# EAGLE design ArduPilotMega_v1 (EAGLE 9.6.2)
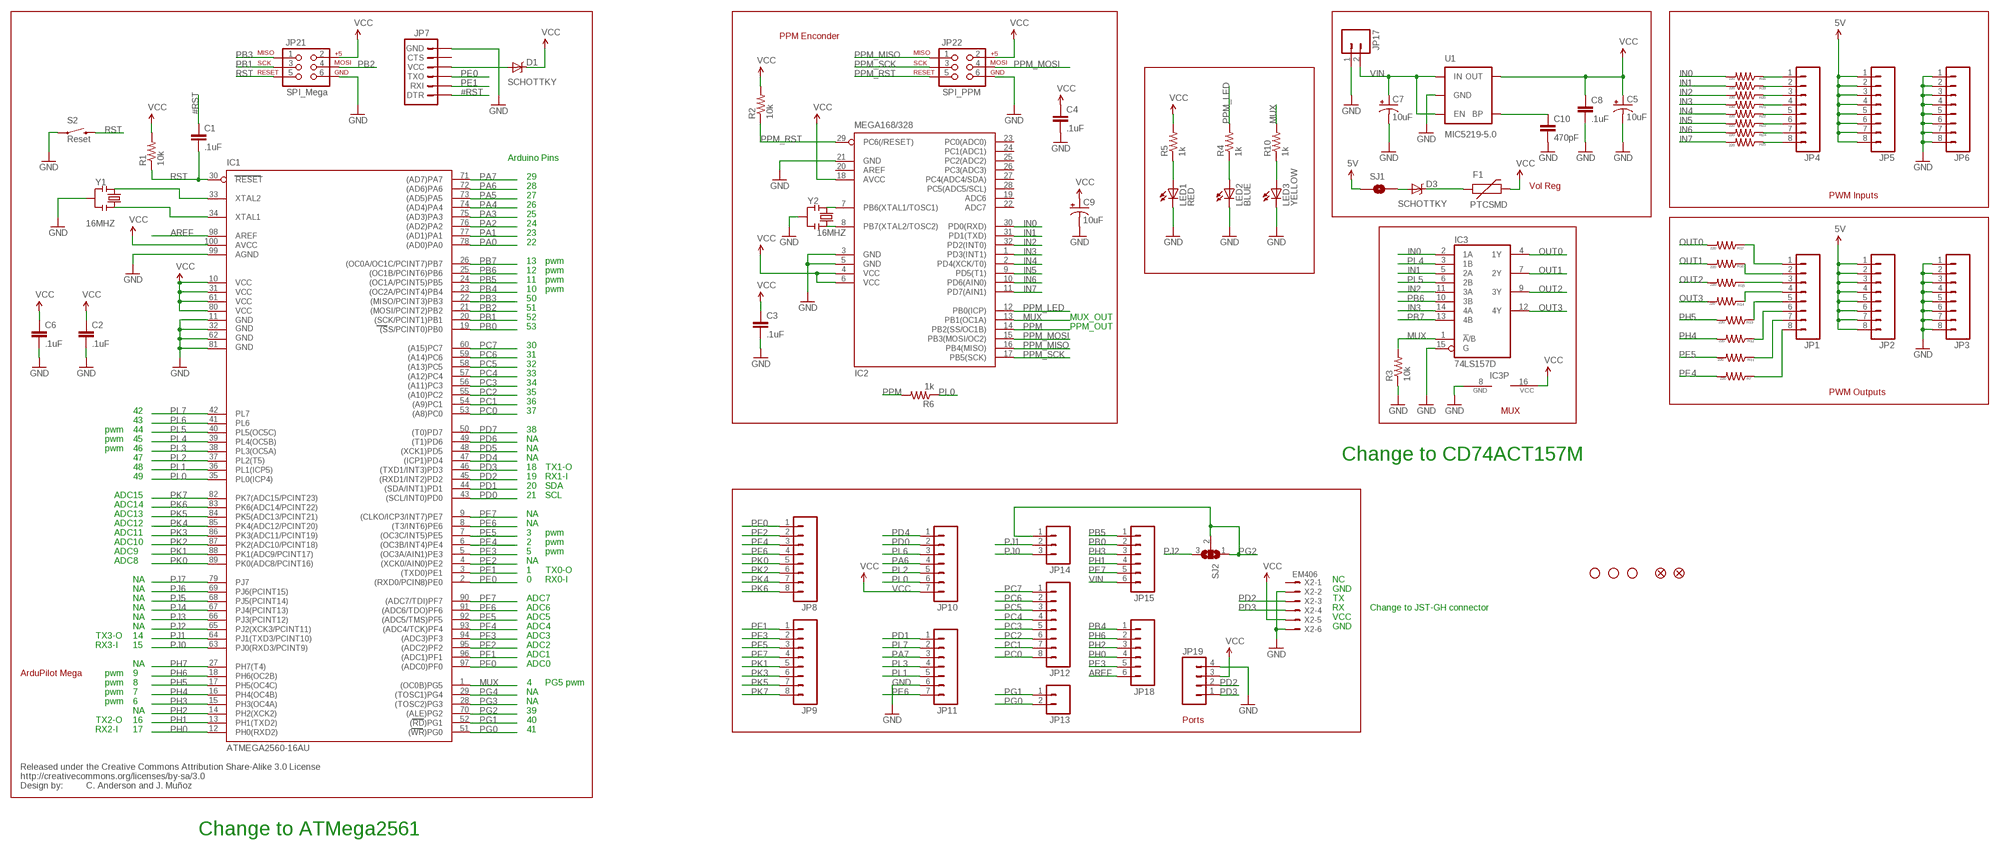
[diagram p0: schematic, sheet 1]

## Parts
C1  .1uF  CAP0402  [C0402]
C2  .1uF  CAP0402  [C0402]
C3  .1uF  CAP0402  [C0402]
C4  .1uF  CAP0402  [C0402]
C5  10uF  CAP_POL1206  [EIA3216]
C6  .1uF  CAP0402  [C0402]
C7  10uF  CAP_POL1206  [EIA3216]
C8  .1uF  CAP0402  [C0402]
C9  10uF  CAP_POL1206  [EIA3216]
C10  470pF  CAP0402  [C0402]
D1  SCHOTTKY  DIODE-SCHOTTKY_  [SMA-DIODE]
D3  SCHOTTKY  DIODE-SCHOTTKY_  [SMA-DIODE]
F1  PTCSMD  [PTC-1206]
IC1  ATMEGA2560-16AU  ATMEGA1280-16AU  [TQFP100]
IC2  MEGA168/328  MEGA8-AI  [TQFP32-08]
IC3  74LS157D  [SO16]
JP1  M08  [1X08]
JP2  M08  [1X08]
JP3  M08  [1X08]
JP4  M08  [1X08]
JP5  M08  [1X08]
JP6  M08  [1X08]
JP7  ARDUINO_SERIAL_PROGRAMPTH  [1X06]
JP8  M08  [1X08]
JP9  M08  [1X08]
JP10  M07  [1X07]
JP11  M07  [1X07]
JP12  M08  [1X08]
JP13  M02PTH  [1X02]
JP14  M03PTH  [1X03]
JP15  M06SIP  [1X06]
JP16  FIDUCIAL1X2  [FIDUCIAL-1X2]
JP17  M02NG  [1X02]
JP18  M06SIP  [1X06]
JP19  M04PTH  [1X04]
JP20  FIDUCIAL1X2  [FIDUCIAL-1X2]
JP21  SPI_Mega  AVR_SPI_PRG_6NS  [2X3-NS]
JP22  SPI_PPM  AVR_SPI_PRG_6NS  [2X3-NS]
LED1  RED  LED0603  [LED-0603]
LED2  BLUE  LED0603  [LED-0603]
LED3  YELLOW  LED0603  [LED-0603]
R1  10k  RESISTOR0402  [C0402]
R2  10k  RESISTOR0402  [C0402]
R3  10k  RESISTOR0402  [C0402]
R4  1k  RESISTOR0402  [C0402]
R5  1k  RESISTOR0402  [C0402]
R6  1k  RESISTOR0402  [C0402]
R7  220  RESISTOR0402  [C0402]
R10  1k  RESISTOR0402  [C0402]
R11  220  RESISTOR0402  [C0402]
R12  220  RESISTOR0402  [C0402]
R13  220  RESISTOR0402  [C0402]
R14  220  RESISTOR0402  [C0402]
R15  220  RESISTOR0402  [C0402]
R16  220  RESISTOR0402  [C0402]
R17  220  RESISTOR0402  [C0402]
R18  220  RESISTOR0402  [C0402]
R19  220  RESISTOR0402  [C0402]
R20  220  RESISTOR0402  [C0402]
R21  220  RESISTOR0402  [C0402]
R22  220  RESISTOR0402  [C0402]
R23  220  RESISTOR0402  [C0402]
R24  220  RESISTOR0402  [C0402]
R25  220  RESISTOR0402  [C0402]
S2  Reset  SWITCH-MOMENTARY-2SMD  [TACTILE_SWITCH_SMD]
SJ1  SJ2  SOLDERJUMPERNC  [SJ_2S]
SJ2  SOLDERJUMPER_2WAYS  [SJ_3]
U1  MIC5219-5.0  V_REG_LDOSMD  [SOT23-5]
U$8  CREATIVE_COMMONS  [CREATIVE_COMMONS]
U$10  STAND-OFF  [STAND-OFF]
U$12  STAND-OFF  [STAND-OFF]
U$13  STAND-OFF  [STAND-OFF]
X2  EM406  GH-06V  [GH-06V]
Y1  16MHZ  RESONATORSMD  [RESONATOR-SMD]
Y2  16MHZ  RESONATORSMD  [RESONATOR-SMD]

## Nets
5V: JP2.1 JP2.2 JP2.3 JP2.4 JP2.5 JP2.6 JP2.7 JP2.8 JP5.1 JP5.2 JP5.3 JP5.4 JP5.5 JP5.6 JP5.7 JP5.8 SJ1.1
#RST: C1.1 JP7.1(DTR)
AREF: IC1.98(AREF) JP18.6
GND: C2.2 C3.2 C4.2 C5.C(-) C6.2 C7.C(-) C8.2 C9.C(-) C10.2 IC1.11(GND) IC1.32(GND1) IC1.62(GND2) IC1.81(GND3) IC1.99(AGND) IC2.3(GND) IC2.5(GND) IC2.21(GND) IC3.8(GND) IC3.15(G) JP3.1 JP3.2 JP3.3 JP3.4 JP3.5 JP3.6 JP3.7 JP3.8 JP6.1 JP6.2 JP6.3 JP6.4 JP6.5 JP6.6 JP6.7 JP6.8 JP7.6(GND) JP11.6 JP17.1 JP19.4 JP21.6 JP22.6 LED1.C LED2.C LED3.C R3.1 S2.1 U1.2(GND) X2.2 X2.6 Y1.2 Y2.2
IN0: IC2.30(PD0(RXD)) IC3.2(1A) R18.2
IN1: IC2.31(PD1(TXD)) IC3.5(2A) R19.2
IN2: IC2.32(PD2(INT0)) IC3.11(3A) R20.2
IN3: IC2.1(PD3(INT1)) IC3.14(4A) R21.2
IN4: IC2.2(PD4(XCK/T0)) R22.2
IN5: IC2.9(PD5(T1)) R23.2
IN6: IC2.10(PD6(AIN0)) R24.2
IN7: IC2.11(PD7(AIN1)) R25.2
MUX: IC1.1((OC0B)PG5) IC2.13(PB1(OC1A)) IC3.1(!A!/B) R3.2 R10.2
N$1: LED1.A R5.1
N$2: LED2.A R4.1
N$3: C10.1 U1.4(BP)
N$5: LED3.A R10.1
N$6: IC2.7(PB6(XTAL1/TOSC1)) Y2.1
N$7: IC2.8(PB7(XTAL2/TOSC2)) Y2.3
N$8: JP1.5 R13.1
N$9: JP1.6 R12.1
N$10: JP1.7 R11.1
N$11: JP1.8 R7.1
N$13: JP1.4 R14.1
N$14: JP1.3 R15.1
N$15: JP1.2 R16.1
N$16: JP1.1 R17.1
N$17: D3.A SJ1.2
N$18: JP4.1 R18.1
N$19: JP4.2 R19.1
N$20: JP4.3 R20.1
N$21: JP4.4 R21.1
N$22: JP4.5 R22.1
N$23: JP4.6 R23.1
N$24: JP4.7 R24.1
N$25: JP4.8 R25.1
N$26: D3.C F1.1
N$27: D1.A JP7.4(VCC)
N$56: IC1.34(XTAL1) Y1.3
N$89: IC1.33(XTAL2) Y1.1
OUT0: IC3.4(1Y) R17.2
OUT1: IC3.7(2Y) R16.2
OUT2: IC3.9(3Y) R15.2
OUT3: IC3.12(4Y) R14.2
PA0: IC1.78((AD0)PA0)
PA1: IC1.77((AD1)PA1)
PA2: IC1.76((AD2)PA2)
PA3: IC1.75((AD3)PA3)
PA4: IC1.74((AD4)PA4)
PA5: IC1.73((AD5)PA5)
PA6: IC1.72((AD6)PA6) JP10.4
PA7: IC1.71((AD7)PA7) JP11.3
PB0: IC1.19((SS/PCINT0)PB0) JP15.2
PB1: IC1.20((SCK/PCINT1)PB1) JP21.3
PB2: IC1.21((MOSI/PCINT2)PB2) JP21.4
PB3: IC1.22((MISO/PCINT3)PB3) JP21.1
PB4: IC1.23((OC2A/PCINT4)PB4) JP18.1
PB5: IC1.24((OC1A/PCINT5)PB5) JP15.1
PB6: IC1.25((OC1B/PCINT6)PB6) IC3.10(3B)
PB7: IC1.26((OC0A/OC1C/PCINT7)PB7) IC3.13(4B)
PC0: IC1.53((A8)PC0) JP12.8
PC1: IC1.54((A9)PC1) JP12.7
PC2: IC1.55((A10)PC2) JP12.6
PC3: IC1.56((A11)PC3) JP12.5
PC4: IC1.57((A12)PC4) JP12.4
PC5: IC1.58((A13)PC5) JP12.3
PC6: IC1.59((A14)PC6) JP12.2
PC7: IC1.60((A15)PC7) JP12.1
PD0: IC1.43((SCL/INT0)PD0) JP10.2
PD1: IC1.44((SDA/INT1)PD1) JP11.1
PD2: IC1.45((RXD1/INT2)PD2) JP19.2 X2.3
PD3: IC1.46((TXD1/INT3)PD3) JP19.1 X2.4
PD4: IC1.47((ICP1)PD4) JP10.1
PD5: IC1.48((XCK1)PD5)
PD6: IC1.49((T1)PD6)
PD7: IC1.50((T0)PD7)
PE0: IC1.2((RXD0/PCIN8)PE0) JP7.3(TXO)
PE1: IC1.3((TXD0)PE1) JP7.2(RXI)
PE2: IC1.4((XCK0/AIN0)PE2)
PE3: IC1.5((OC3A/AIN1)PE3) JP18.5
PE4: IC1.6((OC3B/INT4)PE4) R7.2
PE5: IC1.7((OC3C/INT5)PE5) R11.2
PE6: IC1.8((T3/INT6)PE6) JP11.7
PE7: IC1.9((CLKO/ICP3/INT7)PE7) JP15.5
PF0: IC1.97((ADC0)PF0) JP8.1
PF1: IC1.96((ADC1)PF1) JP9.1
PF2: IC1.95((ADC2)PF2) JP8.2
PF3: IC1.94((ADC3)PF3) JP9.2
PF4: IC1.93((ADC4/TCK)PF4) JP8.3
PF5: IC1.92((ADC5/TMS)PF5) JP9.3
PF6: IC1.91((ADC6/TDO)PF6) JP8.4
PF7: IC1.90((ADC7/TDI)PF7) JP9.4
PG0: IC1.51((WR)PG0) JP13.2
PG1: IC1.52((RD)PG1) JP13.1
PG2: IC1.70((ALE)PG2) JP14.1 SJ2.1 SJ2.2
PG3: IC1.28((TOSC2)PG3)
PG4: IC1.29((TOSC1)PG4)
PH0: IC1.12(PH0(RXD2)) JP18.4
PH1: IC1.13(PH1(TXD2)) JP15.4
PH2: IC1.14(PH2(XCK2)) JP18.3
PH3: IC1.15(PH3(OC4A)) JP15.3
PH4: IC1.16(PH4(OC4B)) R12.2
PH5: IC1.17(PH5(OC4C)) R13.2
PH6: IC1.18(PH6(OC2B)) JP18.2
PH7: IC1.27(PH7(T4))
PJ0: IC1.63(PJ0(RXD3/PCINT9)) JP14.3
PJ1: IC1.64(PJ1(TXD3/PCINT10)) JP14.2
PJ2: IC1.65(PJ2(XCK3/PCINT11)) SJ2.3
PJ3: IC1.66(PJ3(PCINT12))
PJ4: IC1.67(PJ4(PCINT13))
PJ5: IC1.68(PJ5(PCINT14))
PJ6: IC1.69(PJ6(PCINT15))
PJ7: IC1.79(PJ7)
PK0: IC1.89(PK0(ADC8/PCINT16)) JP8.5
PK1: IC1.88(PK1(ADC9/PCINT17)) JP9.5
PK2: IC1.87(PK2(ADC10/PCINT18)) JP8.6
PK3: IC1.86(PK3(ADC11/PCINT19)) JP9.6
PK4: IC1.85(PK4(ADC12/PCINT20)) JP8.7
PK5: IC1.84(PK5(ADC13/PCINT21)) JP9.7
PK6: IC1.83(PK6(ADC14/PCINT22)) JP8.8
PK7: IC1.82(PK7(ADC15/PCINT23)) JP9.8
PL0: IC1.35(PL0(ICP4)) JP10.6 R6.1
PL1: IC1.36(PL1(ICP5)) JP11.5
PL2: IC1.37(PL2(T5)) JP10.5
PL3: IC1.38(PL3(OC5A)) JP11.4
PL4: IC1.39(PL4(OC5B)) IC3.3(1B)
PL5: IC1.40(PL5(OC5C)) IC3.6(2B)
PL6: IC1.41(PL6) JP10.3
PL7: IC1.42(PL7) JP11.2
PPM: IC2.14(PB2(SS/OC1B)) R6.2
PPM_LED: IC2.12(PB0(ICP)) R4.2
PPM_MISO: IC2.16(PB4(MISO)) JP22.1
PPM_MOSI: IC2.15(PB3(MOSI/OC2)) JP22.4
PPM_RST: IC2.29(PC6(/RESET)) JP22.5 R2.1
PPM_SCK: IC2.17(PB5(SCK)) JP22.3
RST: C1.2 IC1.30(RESET) JP21.5 R1.1 S2.3
VCC: C2.1 C3.1 C4.1 C5.A(+) C6.1 C8.1 C9.A(+) D1.C F1.2 IC1.10(VCC) IC1.31(VCC1) IC1.61(VCC2) IC1.80(VCC3) IC1.100(AVCC) IC2.4(VCC) IC2.6(VCC) IC2.18(AVCC) IC3.16(VCC) JP10.7 JP19.3 JP21.2 JP22.2 R1.2 R2.2 R5.2 U1.5(OUT) X2.5
VIN: C7.A(+) JP15.6 JP17.2 U1.1(IN) U1.3(EN)
Unconnected: IC2.19(ADC6) IC2.20(AREF) IC2.22(ADC7) IC2.23(PC0(ADC0)) IC2.24(PC1(ADC1)) IC2.25(PC2(ADC2)) IC2.26(PC3(ADC3)) IC2.27(PC4(ADC4/SDA)) IC2.28(PC5(ADC5/SCL)) JP7.5(CTS) X2.1

## Notes on the sheet
- PPM Enconder
- Arduino Pins
- 29
- 28 | Vol Reg
- 27 | PWM Inputs
- 26
- 25
- 24
- 23
- 22
- 13 | pwm
- 12 | pwm
- 11 | pwm
- 10 | pwm
- 50
- 51
- 52 | MUX_OUT
- 53 | PPM_OUT
- 30
- 31
- 32
- 33
- 34
- 35 | PWM Outputs
- 36
- 42 | 37 | MUX
- 43
- pwm | 44 | 38
- pwm | 45 | NA
- pwm | 46 | NA
- 47 | NA | Change to CD74ACT157M
- 48 | 18 | TX1-O
- 49 | 19 | RX1-I
- 20 | SDA
- ADC15 | 21 | SCL
- ADC14
- ADC13 | NA
- ADC12 | NA
- ADC11 | 3 | pwm
- ADC10 | 2 | pwm
- ADC9 | 5 | pwm
- ADC8 | NA
- 1 | TX0-O
- NA | 0 | RX0-I | NC
- NA | GND
- NA | ADC7 | TX
- NA | ADC6 | RX | Change to JST-GH connector
- NA | ADC5 | VCC
- NA | ADC4 | GND
- TX3-O | 14 | ADC3
- RX3-I | 15 | ADC2
- ADC1
- NA | ADC0
- ArduPilot Mega | pwm | 9
- pwm | 8 | 4 | PG5 pwm
- pwm | 7 | NA
- pwm | 6 | NA
- NA | 39
- TX2-O | 16 | 40 | Ports
- RX2-I | 17 | 41
- C. Anderson and J. Muñoz
- Change to ATMega2561

## Library data of the parts
C1-C4 C6 C8 C10 = DIYdrones3:CAP: Capacitor Standard 0603 ceramic capacitor, and 0.1" leaded capacitor.
C5 C7 C9 = DIYdrones3:CAP_POL: Capacitor Polarized These are standard SMD and PTH capacitors. Normally 10uF, 47uF, and 100uF in electrolytic and tantalum varieties. Always verify the external diameter of the through hole cap, it varies with capacity, voltage, and manufacturer. The EIA devices should be standard.
D1 D3 = SparkFun:DIODE-SCHOTTKY
F1 = SparkFun:PTC: Resettable Fuse PTC Resettable Fuse. Spark Fun Electronics SKU : COM-08357
IC1 = atmel-2010:ATMEGA*: MICROCONTROLLER 64/128/256 Kbytes FLASH 4 Kbytes EEPROM 8 Kbytes SRAM 86 General Purpose I/O pins 12-channels16-bit PWM 4 x Serial USARTs 16-channels 10-bit A/D
IC2 = atmel:MEGA8: MICROCONTROLLER 8 Kbytes FLASH, 1 kbytes SRAM, 512 bytes EEPROM, USART, 6-channel 10 bit ADC, 2-channel 8 bit ADC Pin compatible with Atmega48, ATMega88, ATMega168 Source: avr.lbr; MPN: ATMEGA8-16AU; OC_FARNELL: 9171371; OC_NEWARK: 73M8863
IC3 = 74xx-us:74*157: Quadruple 2-line to 1-line data SELECTOR/MULTIPLEXER
JP1-JP6 JP8 JP9 JP12 = SparkFunv2:M08: Header 8 Standard 8-pin 0.1" header. Use with straight break away headers (SKU : PRT-00116), right angle break away headers (PRT-00553), swiss pins (PRT-00743), machine pins (PRT-00117), and female headers (PRT-00115).
JP7 = SparkFunv2:ARDUINO_SERIAL_PROGRAM
JP10 JP11 = SparkFunv2:M07: Header 7 Standard 7-pin 0.1" header. Use with straight break away headers (SKU : PRT-00116), right angle break away headers (PRT-00553), swiss pins (PRT-00743), machine pins (PRT-00117), and female headers (PRT-00115). NOTES ON THE VARIANTS LOCK and LOCK_LONGPADS... This footprint was designed to help hold the alignment of a through-hole component (i.e. 7-pin header) while soldering it into place. You may notice that each hole has been shifted either up or down by 0.005 of an inch from it's more standard position (which is usually a perfectly straight line). This slight alteration caused the pins (the squares in the middle) to touch the edges of the holes. Because they are alternating, it causes a "brace" to hold the header in place. 0.005 has proven to be the perfect amount of "off-center" position when using our standard breakaway headers. Although looks a little odd when you look at the bare footprint, once you have a header in there, the alteration is very hard to notice. Also, if you push a header all the way into place, it is covered up entirely on the bottom side. This idea of altering the position of holes to aid alignment will be further integrated into the Sparkfun Library for other footprints. It can help hold any component with 3 or more connection pins.
JP13 = SparkFunv2:M02: Header 2 Standard 2-pin 0.1" header. Use with straight break away headers (SKU : PRT-00116), right angle break away headers (PRT-00553), swiss pins (PRT-00743), machine pins (PRT-00117), and female headers (PRT-00115). Molex polarized connector foot print use with SKU : PRT-08233 with associated crimp pins and housings.
JP14 = SparkFunv2:M03: Header 3 Standard 3-pin 0.1" header. Use with straight break away headers (SKU : PRT-00116), right angle break away headers (PRT-00553), swiss pins (PRT-00743), machine pins (PRT-00117), and female headers (PRT-00115). Molex polarized connector foot print use with SKU : PRT-08232 with associated crimp pins and housings.
JP15 JP18 = SparkFunv2:M06: Header 6 Standard 6-pin 0.1" header. Use with straight break away headers (SKU : PRT-00116), right angle break away headers (PRT-00553), swiss pins (PRT-00743), machine pins (PRT-00117), and female headers (PRT-00115). Molex polarized connector foot print use with SKU : PRT-08094 with associated crimp pins and housings. NOTES ON THE VARIANTS LOCK and LOCK_LONGPADS... This footprint was designed to help hold the alignment of a through-hole component (i.e. 6-pin header) while soldering it into place. You may notice that each hole has been shifted either up or down by 0.005 of an inch from it's more standard position (which is a perfectly straight line). This slight alteration caused the pins (the squares in the middle) to touch the edges of the holes. Because they are alternating, it causes a "brace" to hold the component in place. 0.005 has proven to be the perfect amount of "off-center" position when using our standard breakaway headers. Although looks a little odd when you look at the bare footprint, once you have a header in there, the alteration is very hard to notice. Also, if you push a header all the way into place, it is covered up entirely on the bottom side. This idea of altering the position of holes to aid alignment will be further integrated into the Sparkfun Library for other footprints. It can help hold any component with 3 or more connection pins.
JP16 JP20 = SparkFun:FIDUCIAL: Fiducial Alignment Points Various fiducial points for machine vision alignment.
JP17 = SparkFunv2:M02NG
JP19 = SparkFunv2:M04: Header 4 Standard 4-pin 0.1" header. Use with straight break away headers (SKU : PRT-00116), right angle break away headers (PRT-00553), swiss pins (PRT-00743), machine pins (PRT-00117), and female headers (PRT-00115). Molex polarized connector foot print use with SKU : PRT-08231 with associated crimp pins and housings.
JP21 JP22 = SparkFunv2:AVR_SPI_PRG_6: AVR ISP 6 Pin This is the reduced ISP connector for AVR programming. Common on Arduino. This footprint will take up less PCB space and can be used with a 10-pin to 6-pin adapter such as SKU: BOB-08508
LED1-LED3 = DIYdrones3:LED: LEDs Standard schematic elements and footprints for 5mm, 3mm, 1206, and 0603 sized LEDs. 5mm - Spark Fun Electronics SKU : COM-00529 (and others)
R1-R7 R10-R25 = DIYdrones3:RESISTOR: Resistor Basic schematic elements and footprints for 0603, 1206, and PTH 1/10th watt (small) resistors.
S2 = SparkFun:SWITCH-MOMENTARY-2
SJ1 = SparkFun:SOLDERJUMPER: Solder Jumper Standard SMD solder jumper. Used to automate production. Two varients : Normally Open and Normally Closed are the same, but have different paste layers. NC will have a large amount of paste and should jumper during reflow.
SJ2 = DIYdrones3:SOLDERJUMPER_2WAY: Solder Jumper 2 way solder jumper
U1 = SparkFun:V_REG_LDO: Voltage Regulator LDO Standard 150mA LDO voltage regulator in SOT-23 layout. Micrel part MIC5205. BP (by-pass) pin is used to lower output noise with 470pF cap.
U$8 = SparkFun:CREATIVE_COMMONS
U$10 U$12 U$13 = DIYdrones3:STAND-OFF: Stand Off This is the mechanical footprint for a #4 phillips button head screw. Use the keepout ring to avoid running the screw head into surrounding components. SKU : PRT-00447
X2 = jst_gh_con:GH-06V: Disconnectable Crimp style connector, 1.25mm pitch 6 contacts
Y1 Y2 = DIYdrones3:RESONATOR: Resonator Small SMD resonator. This is the itty bitty 10/20MHz resonators with built in caps. CSTCE10M0G55 and CSTCE20M0V53. Footprint has been reviewed closely but hasn't been tested yet.

## Board
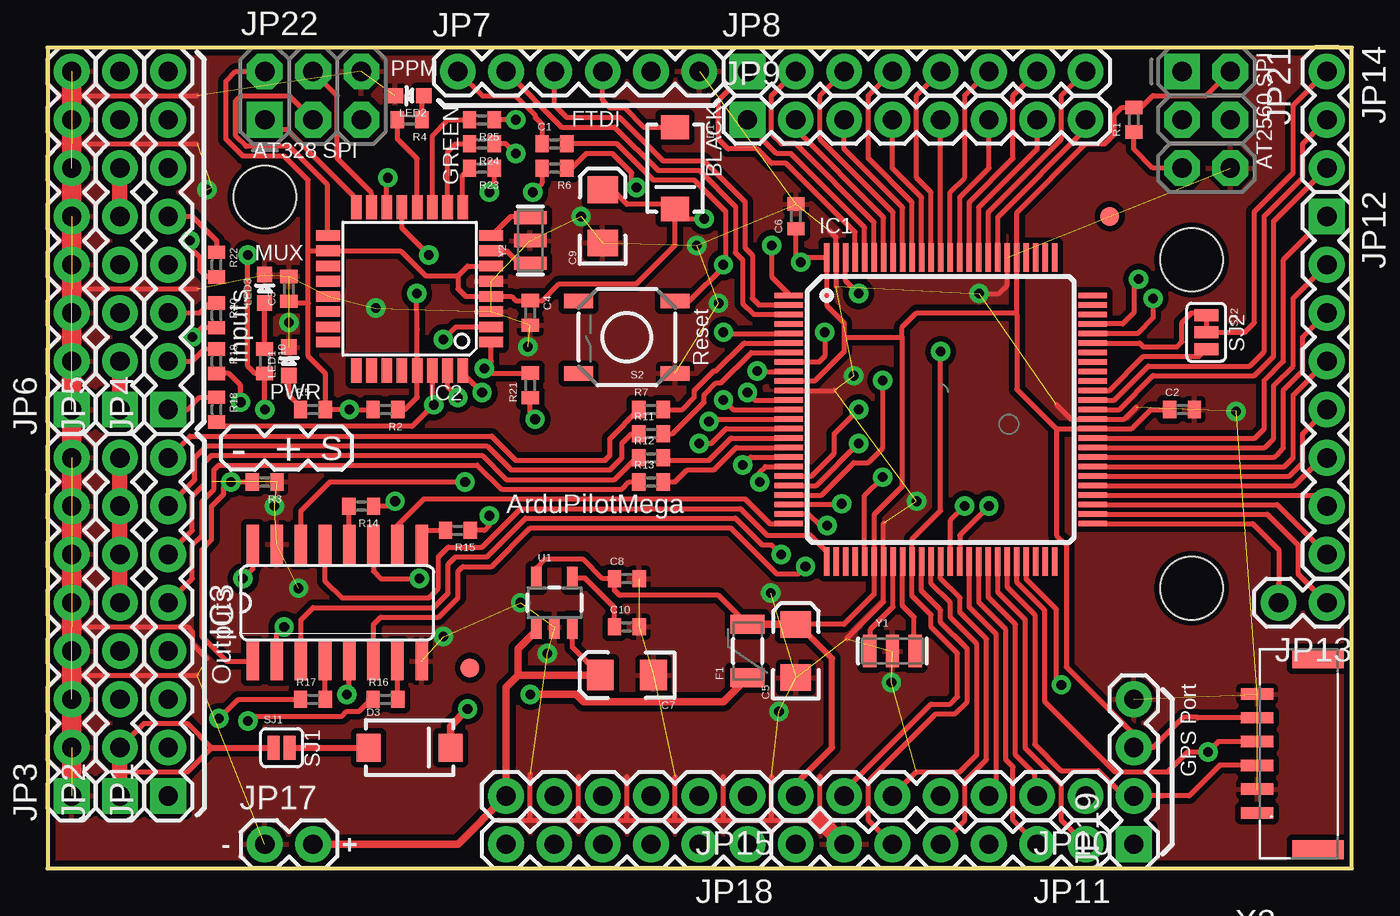
[diagram p1: board, top side]
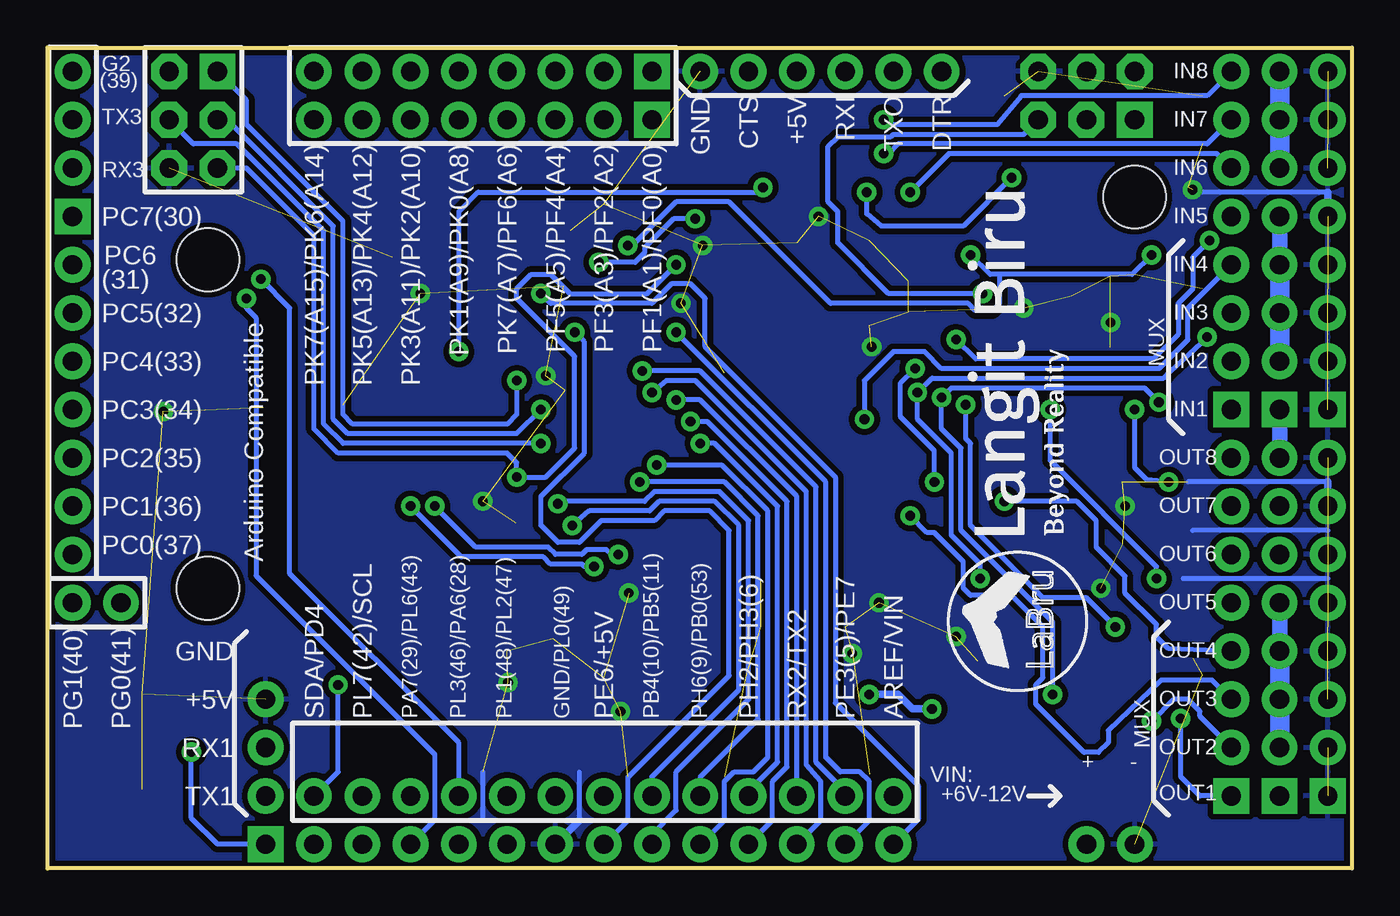
[diagram p2: board, bottom side, seen from below]

Size 68.63 x 43.17 mm. Coordinates in mm from the lower left corner, seen from the top.
Outline: 0,0 68.63,0 68.63,43.17 0,43.17 0,0
Copper layers (1*16): Top 0.035mm / dielectric 1.5mm / Bottom 0.035mm
Design rules "SparkFun *": minimum track width 8mil, minimum drill 20mil, track to track 0.2mm, track to pad 0.2mm, pad to pad 0.2mm, via to via 0.2mm, smd to smd 0.2mm, copper to edge 6mil, drill to drill 6mil, minimum pad ring 12mil, minimum via ring 10mil, stop-mask expansion 4mil, vias tented up to drill 25mil, thermal gap 10mil

### Footprints (pad centres in the part's own frame; a part is rotated, then mirrored left to right if it is on the bottom)
C0402 = smd 0.7 x 0.9: 1 -0.65,0; 2 0.65,0
EIA3216 = smd 1.4 x 1.6: A 1.4,0; C -1.4,0
SMA-DIODE = smd 1.27 x 1.47: A -2.15,0; C 2.15,0
PTC-1206 = smd 1 x 1.8: 1 -1.4,0; 2 1.4,0
TQFP100 = smd 1.5 x 0.3: 1 -8,6; 2 -8,5.5; 3 -8,5; 4 -8,4.5; 5 -8,4; 6 -8,3.5; 7 -8,3; 8 -8,2.5; 9 -8,2; 10 -8,1.5; 11 -8,1; 12 -8,0.5; 13 -8,0; 14 -8,-0.5; 15 -8,-1; 16 -8,-1.5; 17 -8,-2; 18 -8,-2.5; 19 -8,-3; 20 -8,-3.5; 21 -8,-4; 22 -8,-4.5; 23 -8,-5; 24 -8,-5.5; 25 -8,-6; 51 8,-6; 52 8,-5.5; 53 8,-5; 54 8,-4.5; 55 8,-4; 56 8,-3.5; 57 8,-3; 58 8,-2.5; 59 8,-2; 60 8,-1.5; 61 8,-1; 62 8,-0.5; 63 8,0; 64 8,0.5; 65 8,1; 66 8,1.5; 67 8,2; 68 8,2.5; 69 8,3; 70 8,3.5; 71 8,4; 72 8,4.5; 73 8,5; 74 8,5.5; 75 8,6 | smd 0.3 x 1.5: 26 -6,-8; 27 -5.5,-8; 28 -5,-8; 29 -4.5,-8; 30 -4,-8; 31 -3.5,-8; 32 -3,-8; 33 -2.5,-8; 34 -2,-8; 35 -1.5,-8; 36 -1,-8; 37 -0.5,-8; 38 0,-8; 39 0.5,-8; 40 1,-8; 41 1.5,-8; 42 2,-8; 43 2.5,-8; 44 3,-8; 45 3.5,-8; 46 4,-8; 47 4.5,-8; 48 5,-8; 49 5.5,-8; 50 6,-8; 76 6,8; 77 5.5,8; 78 5,8; 79 4.5,8; 80 4,8; 81 3.5,8; 82 3,8; 83 2.5,8; 84 2,8; 85 1.5,8; 86 1,8; 87 0.5,8; 88 0,8; 89 -0.5,8; 90 -1,8; 91 -1.5,8; 92 -2,8; 93 -2.5,8; 94 -3,8; 95 -3.5,8; 96 -4,8; 97 -4.5,8; 98 -5,8; 99 -5.5,8; 100 -6,8
TQFP32-08 = smd 1.27 x 0.559: 1 -4.293,2.8; 2 -4.293,2; 3 -4.293,1.2; 4 -4.293,0.4; 5 -4.293,-0.4; 6 -4.293,-1.2; 7 -4.293,-2; 8 -4.293,-2.8; 17 4.293,-2.8; 18 4.293,-2; 19 4.293,-1.2; 20 4.293,-0.4; 21 4.293,0.4; 22 4.293,1.2; 23 4.293,2; 24 4.293,2.8 | smd 0.559 x 1.27: 9 -2.8,-4.293; 10 -2,-4.293; 11 -1.2,-4.293; 12 -0.4,-4.293; 13 0.4,-4.293; 14 1.2,-4.293; 15 2,-4.293; 16 2.8,-4.293; 25 2.8,4.293; 26 2,4.293; 27 1.2,4.293; 28 0.4,4.293; 29 -0.4,4.293; 30 -1.2,4.293; 31 -2,4.293; 32 -2.8,4.293
SO16 = smd 0.66 x 2.032: 1 -4.445,-3.073; 2 -3.175,-3.073; 3 -1.905,-3.073; 4 -0.635,-3.073; 5 0.635,-3.073; 6 1.905,-3.073; 7 3.175,-3.073; 8 4.445,-3.073; 9 4.445,3.073; 10 3.175,3.073; 11 1.905,3.073; 12 0.635,3.073; 13 -0.635,3.073; 14 -1.905,3.073; 15 -3.175,3.073; 16 -4.445,3.073
1X08 = drill 1.016 pad 1.88 square: 1 0,0 | drill 1.016 pad 1.88: 2 2.54,0; 3 5.08,0; 4 7.62,0; 5 10.16,0; 6 12.7,0; 7 15.24,0; 8 17.78,0
1X06 = drill 1.016 pad 1.88: 1 0,0; 2 2.54,0; 3 5.08,0; 4 7.62,0; 5 10.16,0; 6 12.7,0
1X07 = drill 1.016 pad 1.88: 1 0,0; 2 2.54,0; 3 5.08,0; 4 7.62,0; 5 10.16,0; 6 12.7,0; 7 15.24,0
1X02 = drill 1.016 pad 1.88: 1 0,0; 2 2.54,0
1X03 = drill 1.016 pad 1.88: 1 0,0; 2 2.54,0; 3 5.08,0
FIDUCIAL-1X2 = smd 1 x 1: 1 0,0
1X04 = drill 1.016 pad 1.88 square: 1 0,0 | drill 1.016 pad 1.88: 2 2.54,0; 3 5.08,0; 4 7.62,0
2X3-NS = drill 1.016 pad 1.88 square: 1 -2.54,-1.27 | drill 1.016 pad 1.88 octagon: 2 -2.54,1.27; 3 0,-1.27; 4 0,1.27; 5 2.54,-1.27; 6 2.54,1.27
LED-0603 = smd 0.8 x 0.8: A 0,-0.75; C 0,0.75
TACTILE_SWITCH_SMD = smd 1.524 x 0.762: 1 -2.54,1.905; 2 2.54,1.905; 3 -2.54,-1.905; 4 2.54,-1.905
SJ_2S = smd 0.635 x 1.27: 1 -0.412,0; 2 0.412,0
SJ_3 = smd 0.635 x 1.27: 1 -0.889,0; 2 0,0; 3 0.889,0
SOT23-5 = smd 0.55 x 1.2: 1 -0.95,-1.3; 2 0,-1.3; 3 0.95,-1.3; 4 0.95,1.3; 5 -0.95,1.3
STAND-OFF = hole 3.302: 0,0
GH-06V = smd 0.6 x 1.7: 1 0,-0.9; 2 1.25,-0.9; 3 2.5,-0.9; 4 3.75,-0.9; 5 5,-0.9; 6 6.25,-0.9 | smd 1 x 2.7: FIT@1 -1.95,-4.1; FIT@2 8.1,-4.1
RESONATOR-SMD = smd 0.7 x 1.7: 1 -1.2,0; 2 0,0; 3 1.2,0

### Placement (x,y rotation side)
C1  26.67,38.1 0 top
C2  59.69,24.13 0 top
C3  12.7,30.48 90 top
C4  25.4,29.21 270 top
C5  39.37,11.43 90 top
C6  39.37,34.29 90 top
C7  30.48,10.16 180 top
C8  30.48,15.24 0 top
C9  29.21,34.29 90 top
C10  30.48,12.7 0 top
D1  33.02,36.83 270 top
D3  19.05,6.35 0 top
F1  36.83,11.43 90 top
IC1  46.99,24.13 0 top
IC2  19.05,30.48 180 top
IC3  15.24,13.97 0 top
JP1  6.35,3.81 90 top
JP2  3.81,3.81 90 top
JP3  1.27,3.81 90 top
JP4  6.35,24.13 90 top
JP5  3.81,24.13 90 top
JP6  1.27,24.13 90 top
JP7  21.59,41.91 0 top
JP8  36.83,41.91 0 top
JP9  36.83,39.37 0 top
JP10  54.61,3.81 180 top
JP11  54.61,1.27 180 top
JP12  67.31,34.29 270 top
JP13  67.31,13.97 180 top
JP14  67.31,41.91 270 top
JP15  36.83,3.81 180 top
JP16  55.88,34.29 0 top
JP17  11.43,1.27 0 top
JP18  36.83,1.27 180 top
JP19  57.15,1.27 90 top
JP20  22.23,10.54 0 top
JP21  60.96,39.37 270 top
JP22  13.97,40.64 0 top
LED1  12.7,26.67 0 top
LED2  19.05,40.64 90 top
LED3  11.43,30.48 0 top
R1  57.15,39.37 90 top
R2  17.78,24.13 180 top
R3  11.43,20.32 180 top
R4  19.05,39.37 180 top
R5  13.97,24.13 0 top
R6  26.67,36.83 180 top
R7  31.75,24.13 0 top
R10  11.43,26.67 270 top
R11  31.75,22.86 0 top
R12  31.75,21.59 0 top
R13  31.75,20.32 0 top
R14  16.51,19.05 180 top
R15  21.59,17.78 180 top
R16  17.78,8.89 0 top
R17  13.97,8.89 0 top
R18  8.89,24.13 270 top
R19  8.89,26.67 270 top
R20  8.89,29.08 270 top
R21  25.4,25.4 90 top
R22  8.89,31.75 270 top
R23  22.86,36.83 180 top
R24  22.86,38.1 180 top
R25  22.86,39.37 180 top
S2  30.48,27.94 180 top
SJ1  12.32,6.35 0 top
SJ2  60.96,28.19 270 top
U1  26.67,13.97 0 top
U$8  0,-7.62 0 top  (outside the outline)
U$10  60.2,32 0 top
U$12  11.43,35.31 0 top
U$13  60.2,14.73 0 top
X2  62.74,2.92 90 top
Y1  44.45,11.43 0 top
Y2  25.4,33.02 90 top

### Tracks (layer width: path | path; a pad name or v marks a point on that pad's centre or on a via)
5V
  Top 0.254: 3.81,5.08 7.37,5.08 8.64,6.35 7.37,7.62 5.08,7.62 JP2.2
  Top 0.305: 8.64,6.35 SJ1.1
  Top 0.813: JP5.1 JP5.2 | JP2.1 3.81,5.08 JP2.2 | JP2.8 JP2.7 JP2.6 JP2.5 | JP5.5 JP5.6
  Bottom 0.813: JP5.4 JP5.5 | JP2.4 JP2.5 | JP2.8 JP5.1
  Bottom 1.016: JP5.2 JP5.3 JP5.4 | JP5.8 JP5.7 JP5.6 | JP2.4 JP2.3 JP2.2
#RST
  Top 0.254: JP7.1 22.86,40.64 24.64,40.64 25.65,39.62 25.65,39.5 26.02,39.13 C1.1
AREF  (via drill 0.51)
  Top 0.254: IC1.98 41.99,30.91 v42.67,30.23
  Bottom 0.254: v42.67,30.23 42.16,29.72 36.83,29.72 35.81,30.73 34.8,30.73 34.04,29.97 34.04,27.43 27.18,20.57 27.18,8.7 22.82,4.34 22.82,2.58 JP18.6
GND  (via drill 0.51)  (74 unrouted)
  Top 0.254: 41.15,33.53 41.49,33.19 IC1.99 41.49,30.61 | IC1.11 41.39,25.13 41.4,25.15 | 43.99,18.16 IC1.32 43.99,14.02 42.04,12.07 | IC1.81 50.49,30.68 50.04,30.23 v49.02,30.23 | 53.09,24.38 53.85,23.62 IC1.62 56.65,23.63 57.28,24.26 | 1.27,12.7 7.37,12.7 7.62,12.45 7.62,11.81 8.38,11.05 | 1.27,40.64 7.87,40.64 | 1.27,38.1 7.87,38.1 | 1.27,30.48 7.87,30.48 | 1.27,10.16 7.87,10.16 | 33.02,2.54 33.02,4.83 | 35.56,2.54 35.56,4.83 | 38.1,2.54 38.1,4.83 | 38.1,2.54 40.64,2.54 40.64,4.83 | 35.56,2.54 38.1,2.54 | 33.02,2.54 35.56,2.54 | 25.4,2.54 25.4,4.95 | 27.94,2.54 27.94,4.83 | 30.48,2.54 30.48,4.83 | 23.75,2.54 25.4,2.54 | 25.4,2.54 27.94,2.54 | 27.94,2.54 30.48,2.54 | 30.48,2.54 33.02,2.54
  Top 0.813: 40.64,2.54 JP11.6
  Top 1.016: JP3.1 1.27,10.16 JP6.8
  Bottom 0.254: 1.27,15.24 8.89,15.24 | 1.27,17.78 8.38,17.78 | 1.27,20.32 8.64,20.32 | 1.27,35.56 8.64,35.56 | 45.72,2.54 45.72,5.08 | 40.64,2.54 40.64,5.08
  Bottom 0.406: JP3.7 1.27,20.32 | 8.64,35.56 8.64,35.81 | JP6.5 1.27,35.56 | JP11.6 40.64,2.54
  other vias: 28.07,34.29 42.42,25.91 45.72,19.3 20.83,12.19 17.27,29.46 25.27,27.43 44.4,9.78 35.31,29.72 62.53,24.03 34.16,32.77 13.21,14.73 12.7,28.7 38.48,8.25 38.05,14.48 11.94,19.05 8.38,35.69 24.89,13.97 26.29,11.3
  pour Top (isolate 0.305): 0,43.18 68.58,43.18 68.58,0 0,0
  pour Bottom (isolate 0.305): 0,43.18 68.58,43.18 68.58,0 0,0
IN0  (via drill 0.51)
  Top 0.254: IC3.2 12.06,12.32 v12.45,12.7 | IC2.30 20.25,24.45 v20.32,24.38 19.18,23.24 9.13,23.24 R18.2
  Bottom 0.254: v12.45,12.7 13.97,14.22 16.26,14.22 20.07,18.03 20.07,22.35 20.32,22.61 v20.32,24.38
IN1  (via drill 0.51)
  Top 0.254: IC2.31 21.05,25.3 v21.59,24.77 | IC3.5 15.88,9.27 v15.75,9.14 | v10.16,24.51 10.16,25.4 9.53,26.04 8.9,26.04 R19.2
  Bottom 0.254: v15.75,9.14 15.75,12.95 20.57,17.78 20.57,22.1 21.59,23.11 v21.59,24.77 21.08,25.27 10.92,25.27 v10.16,24.51
IN2  (via drill 0.51)
  Top 0.254: IC2.32 21.85,26.03 v22.86,25.02 | IC3.11 17.14,15.62 17.53,15.24 v19.56,15.24 | v7.62,27.94 8.13,28.45 8.88,28.45 R20.2
  Bottom 0.254: v19.56,15.24 19.56,16 21.08,17.53 21.08,21.84 22.86,23.62 v22.86,25.02 22.1,25.78 9.91,25.78 9.53,26.16 v7.62,27.94
IN3  (via drill 0.51)
  Top 0.254: IC3.14 13.34,18.8 14.86,20.32 v21.97,20.32 | R21.2 23.23,26.05 v22.99,26.29 23.34,26.64 IC2.1
  Bottom 0.254: v21.97,20.32 21.97,21.97 23.75,23.75 23.75,25.53 v22.99,26.29
IN4  (via drill 0.51)
  Top 0.254: IC2.2 21.5,28.48 v20.83,27.81 | v7.49,33.02 7.49,32.64 8,32.13 8,31.5 8.38,31.11 9,31.11 R22.2
  Bottom 0.254: v20.83,27.81 19.81,26.8 10.41,26.8 9.14,28.07 9.14,29.72 8.38,30.48 8.38,32.13 v7.49,33.02
IN5
  Top 0.254: IC2.9 21.85,36.47 R23.2
IN6
  Top 0.254: IC2.10 21.05,37.69 21.46,38.1 R24.2
IN7
  Top 0.254: R25.2 21.08,39.37 20.25,38.54 IC2.11
MUX  (via drill 0.51)
  Top 0.254: IC2.13 18.65,33.67 v20.07,32.26 | v11.43,24.13 R10.2 10.94,26.02 10.54,26.42 v10.54,32.26 | IC3.1 10.71,10.81 | IC3.1 10.79,10.8 | IC3.1 9.42,10.9 8.13,12.19 8.13,16.76 8.64,17.27 8.64,19.05 9.27,19.68 9.27,20.07 v9.65,20.32 R3.2 10.65,20.45 | IC1.1 38.99,30.22 38.1,31.11 v38.1,32.77
  Bottom 0.254: v20.07,32.26 19.05,31.24 18.54,31.24 | 18.54,31.24 11.56,31.24 v10.54,32.26 | v9.65,20.32 10.79,20.45 11.43,21.08 v11.43,24.13 | v38.1,32.77 37.85,32.77 35.56,35.05 32.77,35.05 27.43,29.72 20.19,29.72 19.81,29.34 18.92,29.34 18.54,29.72 18.54,31.24
N$1
  Top 0.254: LED1.A 12.7,24.89 13.46,24.13 R5.1
N$2
  Top 0.254: R4.1 19.7,40.54 LED2.A
N$3
  Top 0.254: U1.4 28.29,15.27 29.84,13.72 29.84,12.71 C10.1
N$5
  Top 0.254: R10.1 LED3.A
N$6
  Top 0.254: IC2.7 24.16,32.48 24.89,31.75 25.33,31.75 Y2.1
N$7
  Top 0.254: IC2.8 23.6,33.5 24.38,34.29 25.33,34.29 Y2.3
N$8
  Top 0.254: JP1.5 7.62,15.24 7.62,17.02 8.13,17.53 8.13,19.3 8.76,19.94 8.76,20.95 9.02,21.21 22.61,21.21 23.88,19.94 30.23,19.94 30.61,20.32 R13.1
N$9
  Top 0.254: JP1.6 7.62,17.78 7.62,19.56 8.26,20.19 8.26,21.34 8.64,21.72 22.86,21.72 24.13,20.45 29.84,20.45 30.97,21.57 R12.1
N$10
  Top 0.254: JP1.7 7.75,20.45 7.75,21.59 8.38,22.22 23.11,22.22 24.38,20.95 29.59,20.95 30.23,21.59 30.23,22.35 30.72,22.84 R11.1
N$11
  Top 0.254: JP1.8 7.49,22.73 23.37,22.73 24.64,21.46 29.34,21.46 29.59,21.72 29.59,22.61 30.35,23.37 30.35,23.38 R7.1
N$13  (via drill 0.51)
  Top 0.254: R14.1 18.03,19.05 v18.29,19.3
  Bottom 0.254: JP1.4 9.65,11.56 10.29,12.19 10.29,12.83 11.94,14.48 11.94,15.37 13.46,16.89 13.46,18.29 14.48,19.3 v18.29,19.3
N$14  (via drill 0.51)
  Top 0.254: R15.1 22.99,17.78 23.24,18.03 v23.24,18.54
  Bottom 0.254: JP1.3 7.37,9.91 10.03,9.91 12.83,7.24 12.83,6.6 13.34,6.1 14.1,6.1 16.64,8.64 16.64,9.65 16.26,10.03 16.26,12.7 17.91,14.35 20.07,14.35 20.45,14.73 20.45,16.13 21.97,17.65 22.35,17.65 v23.24,18.54
N$15  (via drill 0.51)
  Top 0.254: R16.1 16.89,8.89 16.89,8.76 16.38,8.25 15.75,8.25 15.49,8 10.79,8 v10.54,7.75
  Bottom 0.254: v10.54,7.75 9.4,8.89 8.64,8.89 8,8.25 8,8 JP1.2
N$16  (via drill 0.51)
  Top 0.254: R17.1 10.03,8.89 v9.02,7.87
  Bottom 0.254: v9.02,7.87 9.02,4.83 8,3.81 JP1.1
N$17
  Top 0.305: SJ1.2 D3.A
N$18
  Top 0.254: JP4.1 7.37,24.13 8,24.77 8.88,24.77 R18.1
N$19
  Top 0.254: R19.1 8.27,27.32 7.62,26.67 JP4.2
N$20
  Top 0.254: R20.1 8.52,29.73 8,29.21 JP4.3
N$21  (via drill 0.51)
  Top 0.254: R21.1 25.4,23.88 v25.65,23.62
  Bottom 0.254: v25.65,23.62 25.65,25.65 24.13,27.18 22.48,27.18 21.59,26.29 10.16,26.29 8.64,27.81 8.64,29.46 JP4.4
N$22
  Top 0.254: R22.1 8.89,33.02 7.62,34.29 JP4.5
N$23  (via drill 0.51)
  Top 0.254: R23.1 23.51,35.83 v23.24,35.56
  Bottom 0.254: JP4.6 7.11,37.59 21.21,37.59 v23.24,35.56
N$24  (via drill 0.51)
  Top 0.254: R24.1 24.13,38.1 v24.64,37.59
  Bottom 0.254: JP4.7 7.62,38.1 23.88,38.1 24.38,37.59 v24.64,37.59
N$25  (via drill 0.51)
  Top 0.254: v24.64,39.37 R25.1
  Bottom 0.254: JP4.8 7.62,40.64 17.4,40.64 18.67,39.12 24.38,39.12 v24.64,39.37
N$26  (via drill 0.51)
  Top 0.406: F1.1 35.56,8.76 28.19,8.76 27.81,9.14 v25.4,9.14 | D3.C 21.2,7.48 v22.1,8.38
  Bottom 0.406: v22.1,8.38 23.11,8.38 23.88,9.14 v25.4,9.14
N$27
  Top 0.254: JP7.4 29.21,40.39 29.59,40.01 30.35,40.01 31.37,38.99 D1.A
N$56
  Top 0.254: IC1.34 44.99,13.81 45.59,13.21 45.59,11.49 Y1.3
N$89
  Top 0.254: IC1.33 44.49,13.76 43.31,12.57 43.31,11.49 Y1.1
OUT0
  Top 0.254: IC3.4 14.61,8.91 R17.2
OUT1
  Top 0.254: IC3.7 18.41,8.91 R16.2
OUT2
  Top 0.254: 19.81,17.17 IC3.9 19.68,17.78 R15.2
OUT3
  Top 0.254: IC3.12 15.88,19.04 R14.2
PA6  (via drill 0.51)
  Top 0.254: IC1.72 56.57,28.63 57.15,29.21 57.15,30.73 v57.4,30.99
  Bottom 0.254: v57.4,30.99 55.88,29.46 55.88,15.49 46.99,6.6 JP10.4
PA7  (via drill 0.51)
  Top 0.254: IC1.71 57.34,28.13 58.17,28.96 v58.17,29.97
  Bottom 0.254: v58.17,29.97 58.17,29.46 57.66,28.96 57.66,15.4 48.26,6 48.26,2.54 JP11.3
PB0  (via drill 0.51)
  Top 0.254: IC1.19 37.77,21.13 37.47,20.83 v37.47,20.32
  Bottom 0.254: JP15.2 34.29,4.79 31.24,7.84 31.24,18.54 33.02,20.32 v37.47,20.32
PB1  (via drill 0.51)
  Top 0.254: v42.67,24.13 41.4,22.86 41.4,21.84 40.19,20.63 IC1.20
  Bottom 0.254: JP21.3 59.18,39.37 53.59,33.78 53.59,23.62 52.83,22.86 43.94,22.86 v42.67,24.13
PB2  (via drill 0.51)
  Top 0.254: v42.67,22.35 40.45,20.13 IC1.21
  Bottom 0.254: JP21.4 60.96,38.1 58.67,38.1 54.1,33.53 54.1,23.37 53.09,22.35 v42.67,22.35
PB3  (via drill 0.51)
  Top 0.254: v43.94,25.65 43.94,22.1 43.18,21.34 42.42,21.34 40.71,19.63 IC1.22
  Bottom 0.254: JP21.1 58.17,40.39 58.17,39.12 53.09,34.04 53.09,23.88 52.58,23.37 44.45,23.37 43.94,23.88 v43.94,25.65
PB4  (via drill 0.51)
  Top 0.254: IC1.23 41.48,19.13 v41.78,19.18
  Bottom 0.254: JP18.1 36.83,1.78 35.56,3.05 35.56,5.08 31.75,8.89 31.75,18.29 33.27,19.81 36.7,19.81 37.21,19.3 41.66,19.3 v41.78,19.18
PB5  (via drill 0.51)
  Top 0.254: IC1.24 40.04,18.63 40.64,18.03 v41.02,18.03
  Bottom 0.254: JP15.1 36.83,4.83 32.26,9.4 32.26,18.03 33.53,19.3 36.45,19.3 36.96,18.8 40.13,18.8 v41.02,18.03
PB6
  Top 0.254: 18.29,17.17 IC3.10 18.41,18.03 19.81,19.43 36.7,19.43 38,18.13 IC1.25
PB7
  Top 0.254: 14.48,16.92 IC3.13 14.61,15.11 15.49,14.22 20.07,14.22 20.57,14.73 20.57,16.38 21.08,16.89 22.86,16.89 24.89,18.92 36.45,18.92 37.85,17.53 40.13,17.53 40.99,16.67 IC1.26
PC0
  Top 0.254: JP12.8 64.69,19.13 IC1.53
PC1
  Top 0.254: JP12.7 66.73,19.63 IC1.54
PC2
  Top 0.254: JP12.6 67.06,21.59 65.6,20.13 IC1.55
PC3
  Top 0.254: JP12.5 66.04,22.86 66.04,21.34 65.53,20.83 65.33,20.63 IC1.56
PC4
  Top 0.254: JP12.4 65.53,24.89 65.53,21.59 65.07,21.13 IC1.57
PC5
  Top 0.254: JP12.3 66.04,27.94 66.04,26.16 65.02,25.15 65.02,22.1 64.77,21.84 64.56,21.63 IC1.58
PC6
  Top 0.254: JP12.2 65.53,29.97 65.53,26.42 64.52,25.4 64.52,22.61 64.04,22.13 IC1.59
PC7
  Top 0.254: JP12.1 65.02,32 65.02,26.67 64.01,25.65 64.01,23.11 63.52,22.63 IC1.60
PD0
  Top 0.254: IC1.43 49.49,14.26 50.93,12.83 50.93,5.97 51.94,4.95 51.94,3.94 JP10.2
PD1
  Top 0.254: JP11.1 53.34,2.54 53.34,4.42 51.44,6.32 51.44,13.08 49.99,14.53 IC1.44
PD2
  Top 0.254: IC1.45 50.49,14.79 51.94,13.34 51.94,6.52 53.32,5.14 55.3,5.14 56.63,3.81 JP19.2 58.6,3.81 58.67,3.81 60.07,3.81 61.7,5.44 61.72,5.42 X2.3
PD3  (via drill 0.51)
  Top 0.254: IC1.46 50.99,15.05 52.45,13.59 52.45,8.79 56.16,5.08 58.94,5.08 60,6.14 61.04,6.14 v61.06,6.12 61.61,6.67 X2.4
  Bottom 0.254: JP19.1 59.69,1.27 61.06,2.64 v61.06,6.12
PD4  (via drill 0.51)
  Top 0.254: IC1.47 51.49,15.21 53.09,13.62 53.09,9.91 v53.34,9.65
  Bottom 0.254: v53.34,9.65 53.34,5.08 JP10.1
PE0
  Top 0.254: IC1.2 37.43,29.63 37.08,29.97 37.08,32.26 36.7,32.64 36.7,35.05 34.54,37.21 32.38,37.21 30.1,39.5 27.3,39.5 26.67,40.13 JP7.3
PE1
  Top 0.254: JP7.2 27.05,38.99 29.84,38.99 32.13,36.7 34.29,36.7 36.2,34.8 36.2,32.38 36.58,32 36.58,29.72 37.16,29.13 IC1.3
PE3  (via drill 0.51)
  Top 0.254: IC1.5 35.62,28.13 v35.56,28.19
  Bottom 0.254: v35.56,28.19 27.69,20.32 27.69,5.84 26.92,5.08 25.91,5.08 25.4,4.57 25.4,2.54 JP18.5
PE4
  Top 0.254: IC1.6 36.65,27.63 35.18,26.16 35.05,26.16 34.04,25.15 34.04,24.77 33.4,24.13 R7.2
PE5
  Top 0.254: IC1.7 37.04,27.13 35.43,25.53 35.18,25.53 34.54,24.89 34.54,24.51 32.89,22.86 R11.2
PE6  (via drill 0.51)
  Top 0.254: v40.89,28.19 40.89,26.92 40.6,26.63 IC1.8
  Bottom 0.254: 39.37,1.29 JP11.7 38.1,2.54 38.1,4.8 32.77,10.13 32.77,17.78 33.78,18.8 36.2,18.8 36.7,18.29 39.5,18.29 40.64,17.14 41.78,17.14 42.67,18.03 42.67,19.56 40.39,21.84 40.39,27.69 v40.89,28.19
PE7  (via drill 0.51)
  Top 0.254: IC1.9 37.37,26.13 v37.34,26.16
  Bottom 0.254: v37.34,26.16 34.29,26.16 28.19,20.07 28.19,5.59 26.67,4.06 JP15.5
PF0
  Top 0.254: JP8.1 35.31,40.39 35.31,38.35 35.81,37.85 37.34,37.85 38.1,37.08 38.86,37.08 42.49,33.46 IC1.97
PF1
  Top 0.254: JP9.1 37.59,38.61 37.59,38.35 38.35,37.59 39.12,37.59 42.99,33.72 IC1.96
PF2
  Top 0.254: JP8.2 38.1,40.64 38.1,38.61 38.61,38.1 39.37,38.1 43.49,33.98 IC1.95
PF3
  Top 0.254: 39.37,39.12 JP9.2 39.37,38.86 43.99,34.24 IC1.94
PF4
  Top 0.254: IC1.93 44.49,34.5 40.64,38.35 40.64,40.64 JP8.3
PF5
  Top 0.254: IC1.92 44.99,34.77 41.91,37.85 JP9.3
PF6
  Top 0.254: IC1.91 45.49,35.03 43.18,37.34 43.18,40.64 JP8.4
PF7
  Top 0.254: IC1.90 45.99,35.29 44.45,36.83 JP9.4
PG0
  Top 0.254: 64.77,14.99 JP13.2 64.77,16.76 63.75,17.78 63.4,18.13 IC1.51
PG1
  Top 0.254: JP13.1 65.79,15.49 65.79,17.02 64.17,18.63 IC1.52
PG2
  Top 0.254: IC1.70 57.46,27.63 57.66,27.43 59.44,27.43 59.69,27.69 59.69,28.7 60.2,29.21 60.83,29.21 SJ2.1 SJ2.2 62.99,28.19 63.5,28.7 63.5,34.54 65.53,36.58 65.53,40.13 JP14.1
PH0  (via drill 0.51)
  Top 0.254: IC1.12 37.22,24.63 v36.83,25.02
  Bottom 0.254: v36.83,25.02 36.07,25.65 34.54,25.65 28.7,19.81 28.7,5.46 27.94,4.57 27.94,2.54 JP18.4
PH1  (via drill 0.51)
  Top 0.254: v35.56,24.64 36.07,24.13 IC1.13
  Bottom 0.254: v35.56,24.64 34.29,24.64 29.21,19.56 JP15.4
PH2  (via drill 0.51)
  Top 0.254: v34.8,23.49 34.92,23.63 IC1.14
  Bottom 0.254: JP18.3 30.48,2.54 30.48,4.57 29.72,5.33 29.72,19.3 33.91,23.49 v34.8,23.49
PH3  (via drill 0.51)
  Top 0.254: v34.29,22.35 34.92,22.35 35.7,23.13 IC1.15
  Bottom 0.254: JP15.3 31.75,4.06 30.23,5.59 30.23,19.05 33.53,22.35 v34.29,22.35
PH4
  Top 0.254: IC1.16 35.97,22.63 34.8,21.46 32.53,21.46 R12.2
PH5
  Top 0.254: IC1.17 36.23,22.13 35.05,20.95 33.66,20.95 33.02,20.32 R13.2
PH6  (via drill 0.51)
  Top 0.254: IC1.18 37,21.63 v36.58,21.21
  Bottom 0.254: JP18.2 33.02,2.54 33.02,4.57 32.51,5.08 31.5,5.08 30.73,5.84 30.73,18.8 33.15,21.21 v36.58,21.21
PJ0
  Top 0.254: JP14.3 64.52,34.04 64.52,26.92 63.5,25.91 58.17,25.91 56.39,24.13 IC1.63
PJ1
  Top 0.254: JP14.2 66.04,38.1 66.04,36.32 64.01,34.29 64.01,27.18 63.25,26.42 57.91,26.42 56.13,24.63 IC1.64
PJ2
  Top 0.254: IC1.65 55.86,25.13 57.66,26.92 60.58,26.92 SJ2.3
PK0
  Top 0.254: IC1.89 46.49,35.55 45.72,36.32 45.72,40.64 JP8.5
PK1
  Top 0.254: IC1.88 JP9.5
PK2
  Top 0.254: IC1.87 47.49,35.55 48.26,36.32 48.26,40.64 JP8.6
PK3
  Top 0.254: IC1.86 47.99,35.29 49.53,36.83 JP9.6
PK4
  Top 0.254: IC1.85 48.49,35.03 50.8,37.34 50.8,40.64 JP8.7
PK5
  Top 0.254: IC1.84 48.99,34.77 52.07,37.85 JP9.7
PK6
  Top 0.254: IC1.83 49.49,34.5 53.34,38.35 53.34,40.64 JP8.8
PK7
  Top 0.254: IC1.82 49.99,34.24 54.61,38.86 JP9.8
PL0  (via drill 0.51)
  Top 0.254: v46.99,27.18 46.99,18.8 45.49,17.3 IC1.35 45.49,14.33 46.48,13.34 46.48,12.7 47.88,11.3 47.88,9.02 47.5,8.64 46.48,8.64 42.16,4.32 42.16,4.06 JP10.6 | 27.3,36.96 R6.1 27.56,36.83 28.32,37.59 29.72,37.59 30.73,36.58 30.73,36.07 v30.99,35.81
  Bottom 0.254: v46.99,27.18 46.99,34.54 45.97,35.56 31.24,35.56 v30.99,35.81
PL1
  Top 0.254: JP11.5 43.18,2.54 43.18,4.57 46.74,8.13 47.75,8.13 48.39,8.76 48.39,11.56 46.99,12.95 46.99,13.59 45.99,14.59 IC1.36
PL2
  Top 0.254: JP10.5 45.72,5.08 48.01,5.08 48.9,5.97 48.9,11.81 47.5,13.21 47.5,13.97 46.49,14.98 IC1.37
PL3
  Top 0.254: JP11.4 48.26,2.54 48.26,4.57 49.4,5.71 49.4,12.07 48.01,13.46 48.01,14.22 46.99,15.24 IC1.38
PL4  (via drill 0.51)
  Top 0.254: IC1.39 47.49,18.28 v48.26,19.05 | v38.61,16.51 38.1,17.02 37.59,17.02 36.2,18.41 25.15,18.41 23.11,16.38 21.46,16.38 21.08,16 21.08,14.48 20.32,13.72 13.97,13.72 13.34,13.08 IC3.3
  Bottom 0.254: v38.61,16.51 38.99,16.51 39.24,16.76 40.26,16.76 40.51,16.51 41.91,16.51 42.29,16.89 46.1,16.89 v48.26,19.05
PL5  (via drill 0.51)
  Top 0.254: IC1.40 47.99,17.51 v49.53,19.05 | v39.88,15.88 39.5,15.49 38.35,15.49 35.94,17.91 25.4,17.91 23.37,15.88 21.84,15.88 21.59,15.62 21.59,14.22 20.57,13.21 17.53,13.21 17.14,12.83 IC3.6
  Bottom 0.254: v39.88,15.88 40.39,15.88 40.51,16 42.16,16 42.55,16.38 46.86,16.38 v49.53,19.05
PL6
  Top 0.254: IC1.41 48.49,13.74 49.91,12.32 49.91,4.19 JP10.3
PL7
  Top 0.254: JP11.2 50.8,2.54 50.8,5.33 50.42,5.71 50.42,12.57 48.99,14 IC1.42
PPM  (via drill 0.51)
  Top 0.254: v25.53,35.56 26.04,36.07 26.04,36.81 R6.2 | IC2.14 17.85,36.27 v17.91,36.32
  Bottom 0.254: v17.91,36.32 20.45,33.78 24.77,33.78 25.53,34.42 v25.53,35.56
PPM_LED
  Top 0.254: IC2.12 19.45,37.32 18.41,38.35 18.41,39.35 R4.2
PPM_MISO
  Top 0.254: JP22.1 11.94,38.86 12.57,38.86 16.25,35.19 IC2.16
PPM_MOSI
  Top 0.254: JP22.4 15.24,40.64 15.24,37.34 17.05,35.53 IC2.15
PPM_RST  (via drill 0.51)
  Top 0.254: v19.43,30.23 19.45,28.34 IC2.29 19.45,24.78 18.8,24.13 R2.1
  Bottom 0.254: v19.43,30.23 24.38,30.23 27.05,32.89 27.05,34.54 27.56,35.05 27.56,37.97 27.05,38.48 24.26,38.48 24.13,38.61 17.27,38.61 JP22.5
PPM_SCK
  Top 0.254: JP22.3 12.7,40.64 10.16,40.64 9.91,40.39 9.91,38.51 10.44,37.97 12.7,37.97 14.73,35.94 14.73,33.3 IC2.17
RST  (via drill 0.51)
  Top 0.254: IC1.30 42.99,19.62 v43.94,20.57 | R1.1 57.15,37.85 58.17,36.83 JP21.5 | C1.2 29.97,38.1 31.88,36.2 34.04,36.2 35.69,34.54 35.69,31.88 v35.56,31.75 35.56,31.62 33.78,29.84 S2.3
  Bottom 0.254: JP21.5 58.17,36.83 54.61,33.27 54.61,23.11 53.34,21.84 44.45,21.84 43.94,21.34 v43.94,20.57 42.42,20.57 40.89,22.1 40.89,26.92 43.94,29.97 43.94,30.48 43.18,31.24 42.16,31.24 41.15,30.23 37.08,30.23 v35.56,31.75
VCC  (via drill 0.51)
  Top 0.254: 21.59,31.17 19.88,31.17 18.57,32.48 IC2.18 13.75,32.48 13.72,32.51 | 21.59,31.17 21.59,30.48 21.99,30.08 IC2.4 24.4,30.08 24.62,29.86 C4.1 26.05,29.86 26.92,30.73 30.99,30.73 33.02,32.77 D1.C | 53.09,23.11 50.99,25.21 50.99,29.15 | 53.09,23.11 53.96,23.11 IC1.61 57.04,23.13 58.04,24.13 C2.1 | 41.91,27.94 41.91,27.18 40.36,25.63 IC1.10 | 23.41,31.75 IC2.6 22.1,31.68 21.59,31.17 | JP22.2 9.91,41.91 9.4,41.4 9.4,38.35 10.29,37.46 12.45,37.46 13.72,36.2 13.72,32.51 | 13.72,29.72 13.1,29.72 C3.1 | 41.91,27.94 41.91,28.7 40.99,29.62 IC1.100 | 13.72,29.72 13.72,32.51 | 50.99,29.15 IC1.80 50.99,34.48 54.61,38.1 55.63,38.1 56.13,38.61 56.13,39.62 56.53,40.02 R1.2 57.55,40.02 58.17,40.64 60.96,40.64 JP21.2 | R2.2 v15.88,24.13 R5.2 14.62,26.02 13.72,26.92 13.72,29.72 | 50.99,29.15 50.93,29.21 45.72,29.21 44.96,28.45 44.96,27.94 | 44.96,27.94 44.96,20.07 43.49,18.6 IC1.31 43.49,14.41 41.91,12.83 C5.A | 41.91,27.94 44.96,27.94 | IC1.100 | 53.09,23.11 53.09,17.53 53.59,17.02 53.59,10.6 57.15,7.04 JP19.3 58.17,6.35 59.76,7.94 60.5,7.94 60.52,7.92 X2.5 | C9.A 29.71,35.69 30.48,34.92 33.02,34.92 D1.C | C6.1 39.37,32.13 v39.62,31.88 39.88,32.13 IC1.100 | IC3.16 10.79,15.75 v10.29,15.24 | F1.2 35.31,14.35 30.1,14.35 29.83,14.62 C8.1 29.21,15.24 28.19,16.26 26.16,16.26 25.72,15.81 U1.5 | v34.54,34.16 33.54,34.16 D1.C
  Top 0.305: F1.2 | JP10.7 39.62,4.06 39.62,4.7 41.27,6.35 41.27,11.05 39.49,12.83
  Top 0.406: F1.2 C5.A 39.49,12.83
  Bottom 0.254: v34.54,34.16 35.69,34.16 37.21,32.64 37.21,32.38 37.72,31.88 v39.62,31.88 | v10.29,15.24 10.29,15.88 15.88,21.46 v15.88,24.13
VIN
  Top 0.254: C7.A 27.62,11.62 U1.3
  Top 0.406: 24.77,10.16 24.13,9.53 JP15.6 21.59,1.27 JP17.2 | 24.77,10.16 C7.A | 24.77,10.16 24.77,11.56 25.72,12.51 U1.1

### Text on the board
tPlace: AT2560 SPI | PPM | GREEN | BLACK | FTDI | AT328 SPI | MUX | SJ2 | Inputs | Reset | PWR | - | + | S | ArduPilotMega | Outputs | SJ1 | GPS Port | - | +
bPlace: IN8 | G2 | DTR | TXO | RXI | +5V | CTS | GND | (39) | TX3 | IN7 | PF1(A1)/PF0(A0) | PF3(A3)/PF2(A2) | PF5(A5)/PF4(A4) | PK7(A7)/PF6(A6) | PK1(A9)/PK0(A8) | PK3(A11)/PK2(A10) | PK5(A13)/PK4(A12) | PK7(A15)/PK6(A14) | IN6 | RX3 | IN5 | PC7(30) | IN4 | PC6 | (31) | IN3 | MUX | PC5(32) | IN2 | PC4(33) | IN1 | PC3(34) | OUT8 | PC2(35) | OUT7 | PC1(36) | OUT6 | Arduino Compatible | PC0(37) | OUT5 | PG0(41) | PG1(40) | OUT4 | GND | +5V | OUT3 | MUX | AREF/VIN | PE3(5)/PE7 | RX2/TX2 | PH2/PH3(6) | PH6(9)/PB0(53) | PB4(10)/PB5(11) | PE6/+5V | GND/PL0(49) | PL1(48)/PL2(47) | PL3(46)/PA6(28) | PA7(29)/PL6(43) | PL7(42)/SCL | SDA/PD4 | RX1 | OUT2 | - | + | VIN: | +6V-12V | TX1 | OUT1
tNames: C. Anderson and J. Muñoz